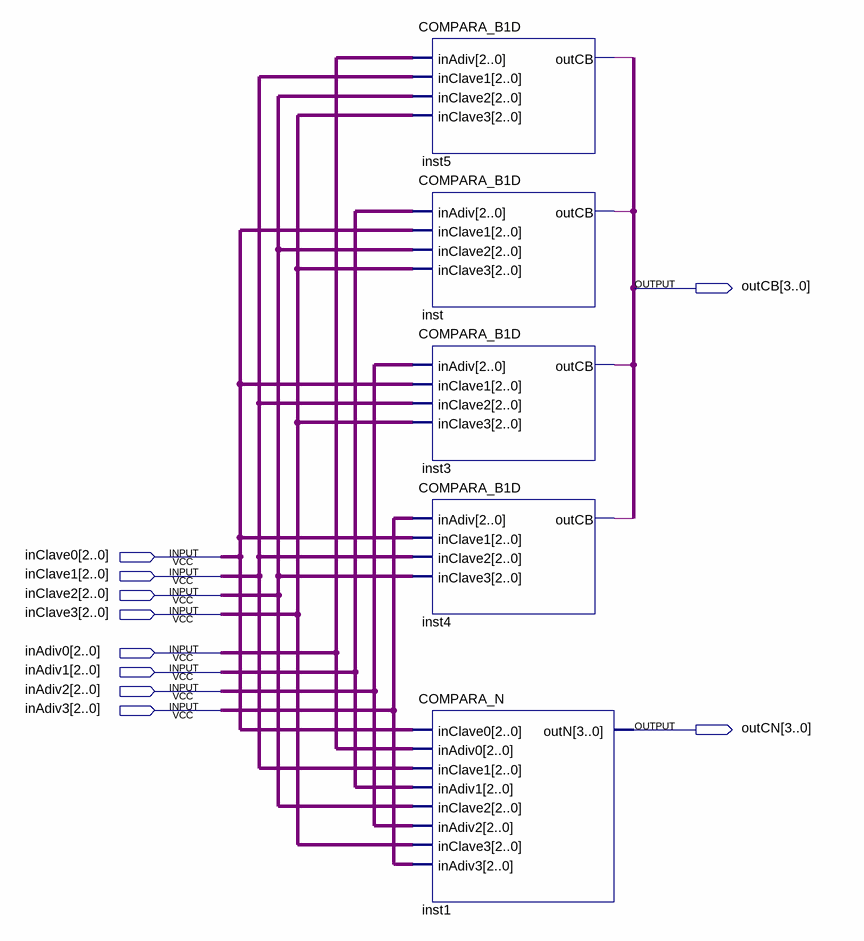
[diagram p0: schematic sheet]
// Quartus schematic COMPARA_BN.bdf as structural Verilog: 5 symbols, 10 pins
module COMPARA_BN (
  input  [2:0] inClave0,
  input  [2:0] inClave1,
  input  [2:0] inClave2,
  input  [2:0] inClave3,
  input  [2:0] inAdiv0,
  input  [2:0] inAdiv1,
  input  [2:0] inAdiv2,
  input  [2:0] inAdiv3,
  output [3:0] outCB,
  output [3:0] outCN
);

  COMPARA_B1D inst5 (.inAdiv(inAdiv0), .inClave1(inClave1), .inClave2(inClave2), .inClave3(inClave3), .outCB(outCB[0]));
  COMPARA_B1D inst (.inAdiv(inAdiv1), .inClave1(inClave0), .inClave2(inClave2), .inClave3(inClave3), .outCB(outCB[1]));
  COMPARA_B1D inst3 (.inAdiv(inAdiv2), .inClave1(inClave0), .inClave2(inClave1), .inClave3(inClave3), .outCB(outCB[2]));
  COMPARA_B1D inst4 (.inAdiv(inAdiv3), .inClave1(inClave0), .inClave2(inClave1), .inClave3(inClave2), .outCB(outCB[3]));
  COMPARA_N inst1 (
    .inClave0(inClave0), .inAdiv0(inAdiv0), .inClave1(inClave1), .inAdiv1(inAdiv1), .inClave2(inClave2),
    .inAdiv2(inAdiv2), .inClave3(inClave3), .inAdiv3(inAdiv3), .outN(outCN));
endmodule
